# Altium schematic sheet [33] - REVISION HISTORY.SchDoc
size A3; DocumentNumber: 31; SheetNumber: 31; SheetTotal: 32
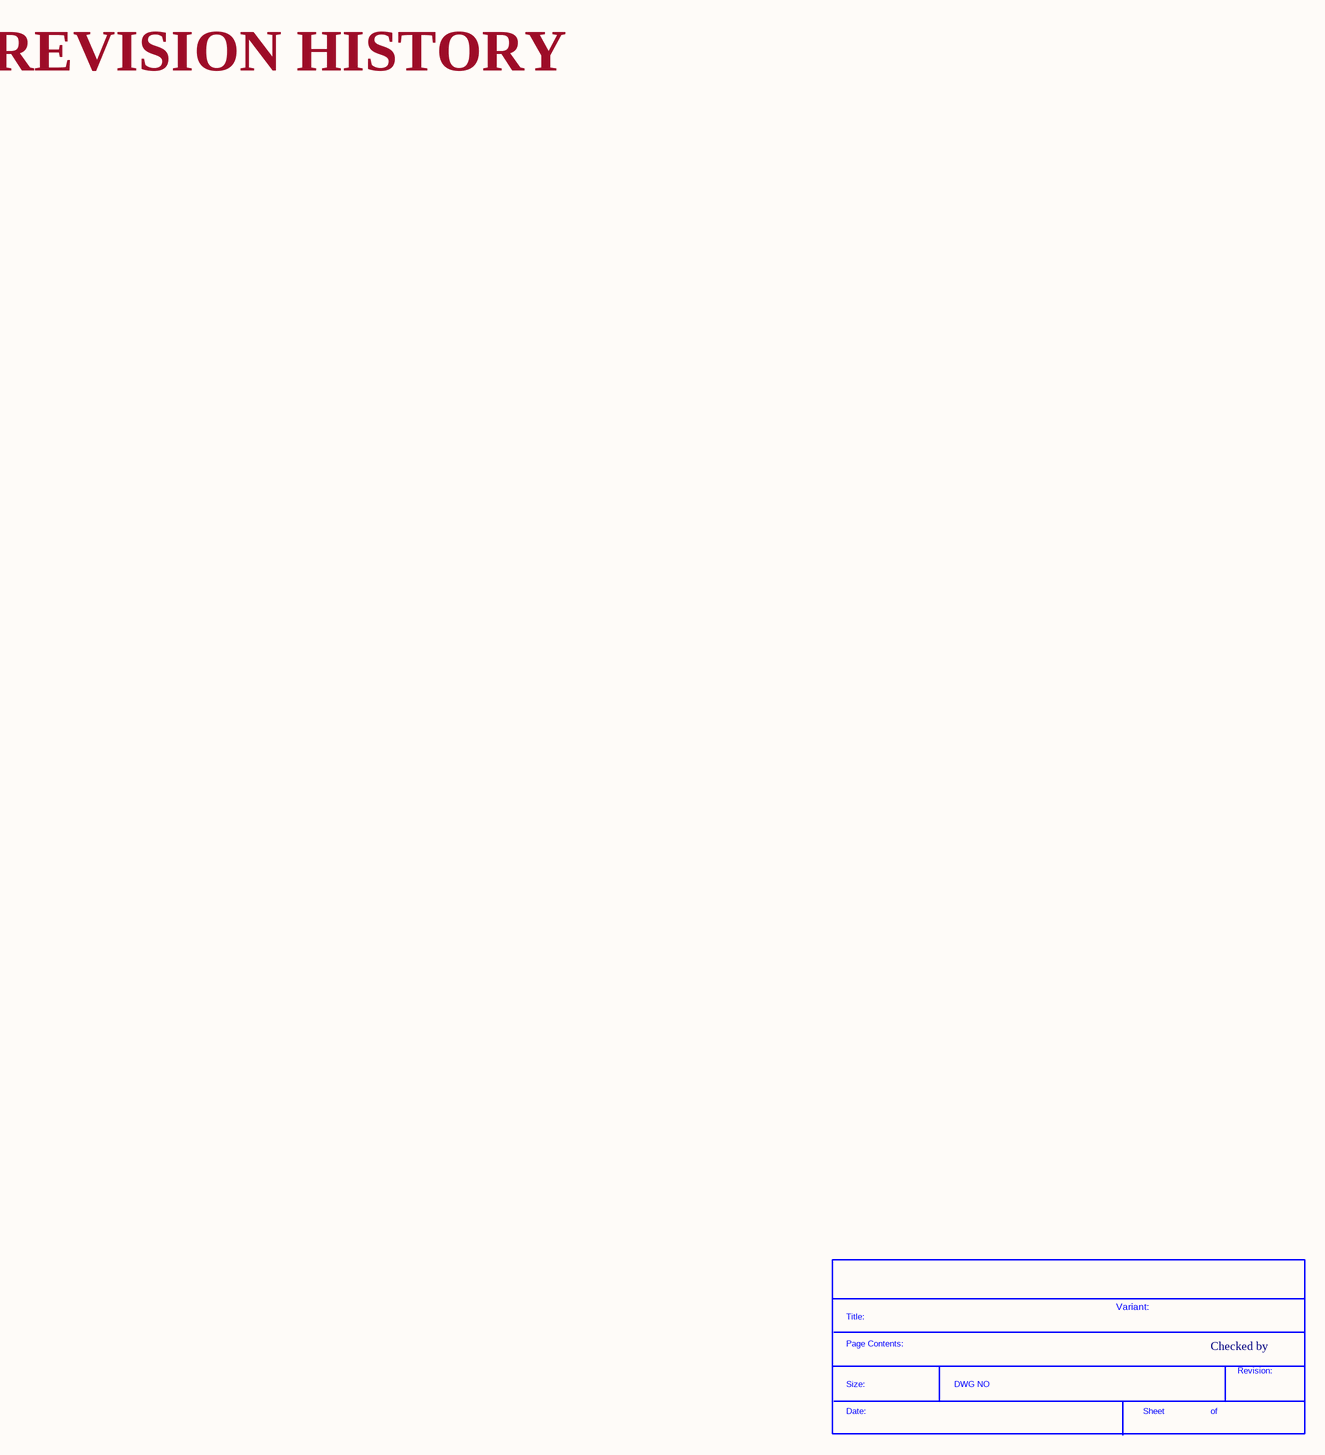
[diagram p0: [33] - REVISION HISTORY.SchDoc]

## Parts
*  SDTitleBlock  (value not drawn)  (graphical)

## Notes on the sheet
- REVISION HISTORY
- Variant:
- Checked by
- (in symbol SDTitleBlock) Title:; Page Contents:; Revision:; Size:; DWG NO; Date:; Sheet; of